# Altium schematic sheet SK-Additional_keys.SchDoc
size A; SheetNumber: 3; SheetTotal: 4
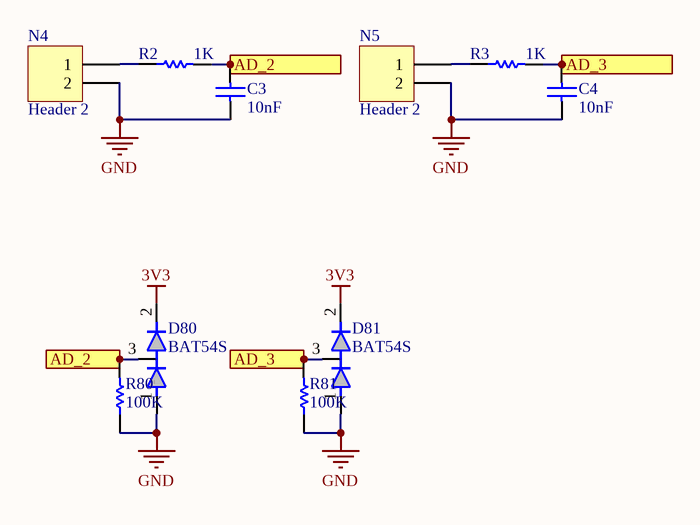
[diagram p0: SK-Additional_keys.SchDoc]

## Parts
C3  10nF  [SMH_RES0805-STD]
C4  10nF  [SMH_RES0805-STD]
D80  BAT54S  [SMH_SOT-23]
D81  BAT54S  [SMH_SOT-23]
N4  Header 2  [SMH_HDR1X2]
N5  Header 2  [SMH_HDR1X2]
R2  1K  [SMH_RES0805-STD]
R3  1K  [SMH_RES0805-STD]
R80  100K  [SMH_RES0805-STD]
R81  100K  [SMH_RES0805-STD]

## Ports
AD_2, AD_3

## Nets
3V3: D80.2 D81.2
GND: C3.2 C4.2 D80.1 D81.1 N4.2 N5.2 R80.1 R81.1
AD_2: C3.1 D80.3 R2.2 R80.2 ; port AD_2
AD_3: C4.1 D81.3 R3.2 R81.2 ; port AD_3
NetN4_1: N4.1 R2.1
NetN5_1: N5.1 R3.1

## Library data of the parts
C3 C4 = Cap: Capacitor; Published: 8-Jun-2000; LatestRevisionDate: 17-Jul-2002; LatestRevisionNote: Re-released for DXP Platform.; PackageReference: RAD-0.3; Publisher: Altium Limited; Value: 10nF
N4 N5 = Header 2: Header, 2-Pin; LatestRevisionDate: 17-Jul-2002; LatestRevisionNote: Re-released for DXP Platform.; Publisher: Altium Limited
R2 R3 R80 R81 = Res1: Resistor; Published: 8-Jun-2000; LatestRevisionDate: 17-Jul-2002; LatestRevisionNote: Re-released for DXP Platform.; PackageReference: AXIAL-0.3; Publisher: Altium Limited; PackageDescription: Axial Device, Thru-Hole; 2 Leads; 0.3 in Pin Spacing
  R2 R3: Value: 1K
  R80 R81: Value: 100K
D80 D81 = BAT54S: value: BAT54S